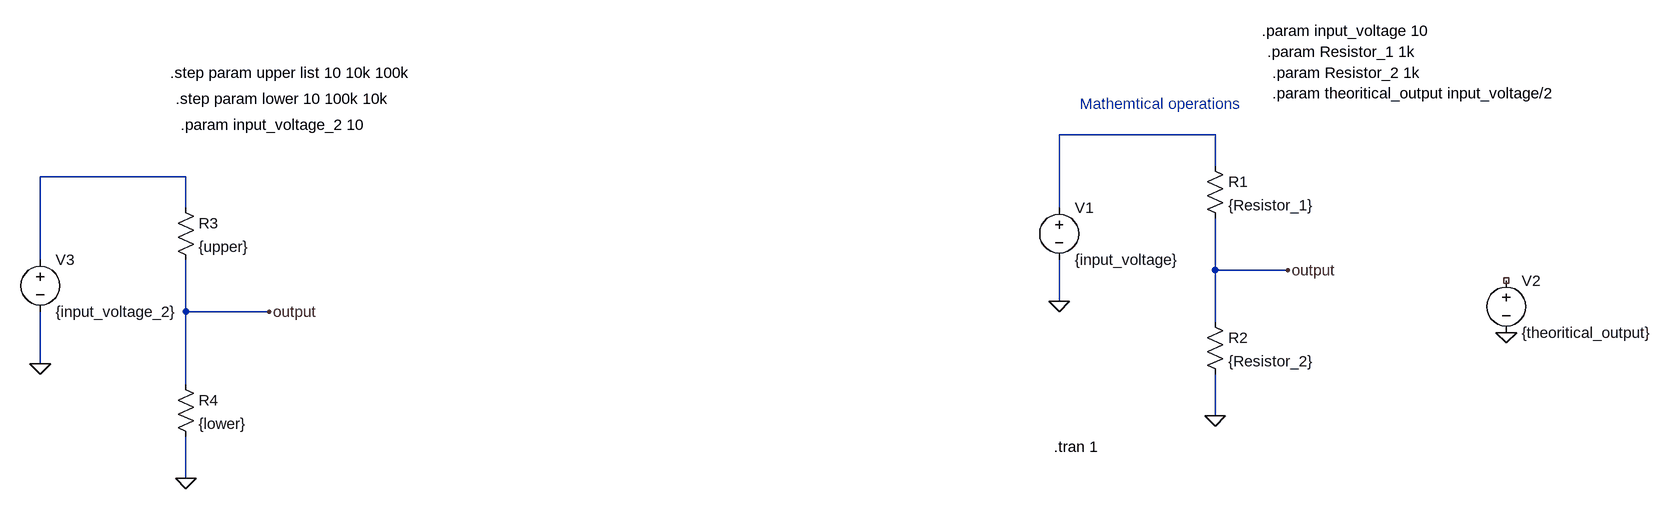
[diagram p0: schematic Parametric_sweep.asc]
Parametric_sweep.asc, the LTspice schematic file:
Version 4.1
SHEET 1 984 680
WIRE 272 96 32 96
WIRE 272 144 272 96
WIRE -1312 160 -1536 160
WIRE -1312 208 -1312 160
WIRE 32 208 32 96
WIRE -1536 288 -1536 160
WIRE 272 304 272 224
WIRE 384 304 272 304
WIRE 32 352 32 288
WIRE -1312 368 -1312 288
WIRE -1184 368 -1312 368
WIRE 272 384 272 304
WIRE -1536 448 -1536 368
WIRE -1312 480 -1312 368
WIRE 272 528 272 464
WIRE -1312 624 -1312 560
FLAG 32 352 0
FLAG 272 528 0
FLAG 384 304 output
FLAG 720 400 0
FLAG -1536 448 0
FLAG -1312 624 0
FLAG -1184 368 output
SYMBOL voltage 32 192 R0
WINDOW 123 0 0 Left 0
WINDOW 39 0 0 Left 0
SYMATTR InstName V1
SYMATTR Value {input_voltage}
SYMBOL res 256 128 R0
SYMATTR InstName R1
SYMATTR Value {Resistor_1}
SYMBOL res 256 368 R0
SYMATTR InstName R2
SYMATTR Value {Resistor_2}
SYMBOL voltage 720 304 R0
SYMATTR InstName V2
SYMATTR Value {theoritical_output}
SYMBOL voltage -1536 272 R0
WINDOW 123 0 0 Left 0
WINDOW 39 0 0 Left 0
SYMATTR InstName V3
SYMATTR Value {input_voltage_2}
SYMBOL res -1328 192 R0
SYMATTR InstName R3
SYMATTR Value {upper}
SYMBOL res -1328 464 R0
SYMATTR InstName R4
SYMATTR Value {lower}
TEXT 64 48 Left 2 ;Mathemtical operations
TEXT 344 -64 Left 2 !.param input_voltage 10
TEXT 352 -32 Left 2 !.param Resistor_1 1k
TEXT 360 0 Left 2 !.param Resistor_2 1k
TEXT 360 32 Left 2 !.param theoritical_output input_voltage/2
TEXT 24 576 Left 2 !.tran 1
TEXT -1336 0 Left 2 !.step param upper list 10 10k 100k
TEXT -1328 40 Left 2 !.step param lower 10 100k 10k
TEXT -1320 80 Left 2 !.param input_voltage_2 10

The netlist it stands for:
* Parametric_sweep.asc
V1 N001 0 {input_voltage}
R1 N001 output {Resistor_1}
R2 output 0 {Resistor_2}
V2 NC_01 0 {theoritical_output}
V3 N002 0 {input_voltage_2}
R3 N002 output {upper}
R4 output 0 {lower}
* Mathemtical operations
.param input_voltage 10
.param Resistor_1 1k
.param Resistor_2 1k
.param theoritical_output input_voltage/2
.tran 1
.step param upper list 10 10k 100k
.step param lower 10 100k 10k
.param input_voltage_2 10
.backanno
.end